# EAGLE design lp_rgb (EAGLE 6.6.0)
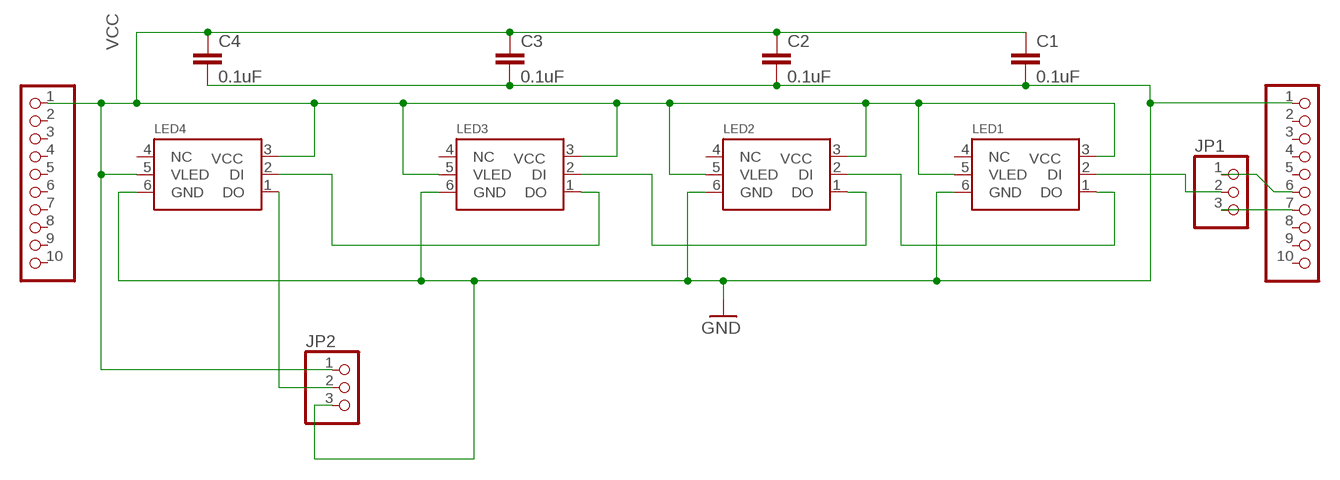
[diagram p0: schematic, sheet 1]

## Parts
C1  0.1uF  C-EUC0805  [C0805]
C2  0.1uF  C-EUC0805  [C0805]
C3  0.1uF  C-EUC0805  [C0805]
C4  0.1uF  C-EUC0805  [C0805]
J1  J1  PINHD-1X10  [1X10]
J2  J2  PINHD-1X10  [1X10]
JP1  PINHD-1X3  [1X03]
JP2  PINHD-1X3  [1X03]
LED1  5050WS2811W  [RGBLED5050W]
LED2  5050WS2811W  [RGBLED5050W]
LED3  5050WS2811W  [RGBLED5050W]
LED4  5050WS2811W  [RGBLED5050W]

## Nets
GND: C1.2 C2.2 C3.2 C4.2 J2.1 JP2.3 LED1.6(GND) LED2.6(GND) LED3.6(GND) LED4.6(GND)
N$1: J2.6 JP1.1
N$2: JP2.2 LED4.1(DO)
N$3: LED1.1(DO) LED2.2(DI)
N$4: LED2.1(DO) LED3.2(DI)
N$5: LED3.1(DO) LED4.2(DI)
N$6: J2.7 JP1.3
P1.6: JP1.2 LED1.2(DI)
VCC [VCC]: C1.1 C2.1 C3.1 C4.1 J1.1 JP2.1 LED1.3(VCC) LED1.5(VLED) LED2.3(VCC) LED2.5(VLED) LED3.3(VCC) LED3.5(VLED) LED4.3(VCC) LED4.5(VLED)
Unconnected: J1.2 J1.3 J1.4 J1.5 J1.6 J1.7 J1.8 J1.9 J1.10 J2.2 J2.3 J2.4 J2.5 J2.8 J2.9 J2.10 LED1.4(NC) LED2.4(NC) LED3.4(NC) LED4.4(NC)

## Library data of the parts
C1-C4 = resistor:C-EU: CAPACITOR, European symbol
J1 J2 = pinhead:PINHD-1X10: PIN HEADER
JP1 JP2 = pinhead:PINHD-1X3: PIN HEADER
LED1-LED4 = 5050WS2811:5050WS2811

## Net classes
0 default: width 0.406 mm, drill 0.508 mm
1 GND: width 0.813 mm, drill 0.508 mm
2 VCC: width 1.016 mm, drill 0.508 mm

## Board
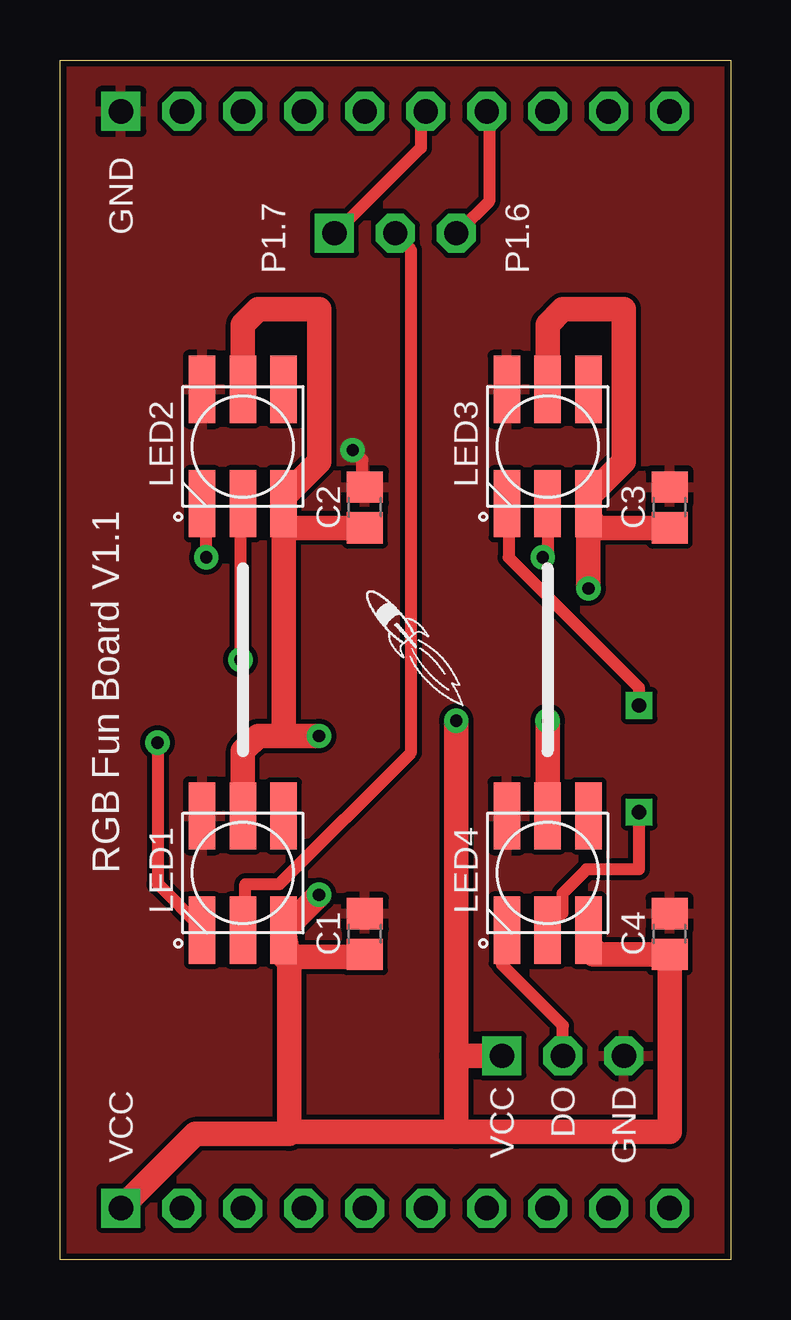
[diagram p1: board, top side]
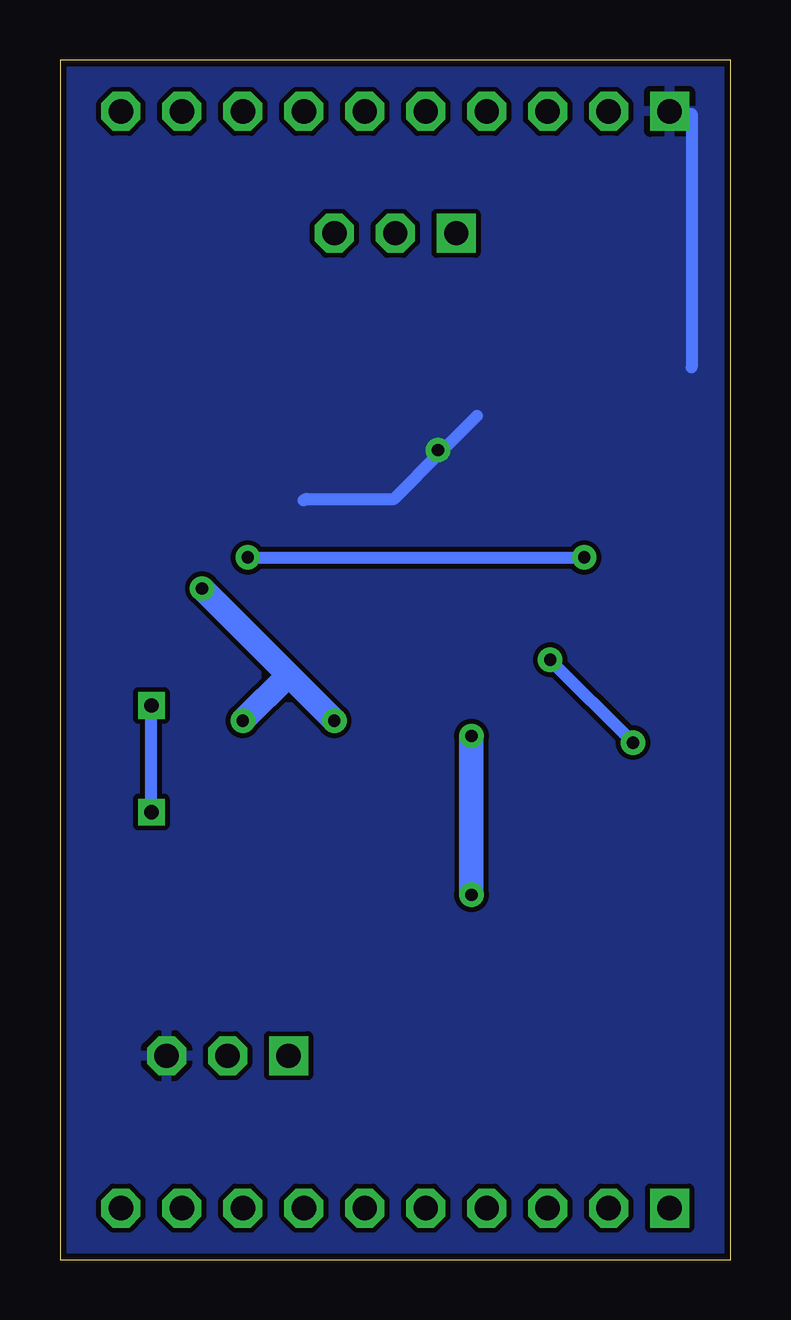
[diagram p2: board, bottom side, seen from below]

Size 27.94 x 50 mm. Coordinates in mm from the lower left corner, seen from the top.
Outline: 0,50 27.94,50 27.94,0 0,0 0,50
Copper layers (1*16): Top 0.035mm / dielectric 1.5mm / Bottom 0.035mm
Design rules "SparkFun *": minimum track width 20mil, minimum drill 20mil, track to track 8mil, track to pad 8mil, pad to pad 8mil, via to via 8mil, smd to smd 8mil, copper to edge 10mil, drill to drill 8mil, minimum pad ring 12mil, minimum via ring 10mil, stop-mask expansion 4mil, vias tented up to drill 25mil, thermal gap 10mil

### Footprints (pad centres in the part's own frame; a part is rotated, then mirrored left to right if it is on the bottom)
C0805 = smd 1.3 x 1.5: 1 -0.85,0; 2 0.85,0
1X10 = drill 1.016 square: 1 -11.43,0 | drill 1.016 octagon: 2 -8.89,0; 3 -6.35,0; 4 -3.81,0; 5 -1.27,0; 6 1.27,0; 7 3.81,0; 8 6.35,0; 9 8.89,0; 10 11.43,0
1X03 = drill 1.016 square: 1 -2.54,0 | drill 1.016 octagon: 2 0,0; 3 2.54,0
RGBLED5050W = smd 2.794 x 1.1: 1 -2.381,1.7; 2 -2.381,0; 3 -2.381,-1.7; 4 2.381,-1.7; 5 2.381,0; 6 2.381,1.7

### Placement (x,y rotation side)
C1  12.7,13.57 90 top
C2  12.7,31.35 90 top
C3  25.4,31.35 90 top
C4  25.4,13.57 90 top
J1  13.97,2.14 0 top
J2  13.97,47.86 0 top
JP1  13.97,42.78 0 top
JP2  20.95,8.49 0 top
LED1  7.62,16.11 90 top
LED2  7.62,33.89 90 top
LED3  20.32,33.89 90 top
LED4  20.32,16.11 90 top
U$2  [LOGO-ROCKET]  14.61,25.64 90 top

### Tracks (layer width: path | path; a pad name or v marks a point on that pad's centre or on a via)
GND  (via drill 0.51)
  Top 0.508: v12.19,33.74 12.6,33.33 12.6,32.32 C2.2
  Bottom 0.508: 12.09,33.64 14.02,31.71 17.68,31.71 17.79,31.64 | 12.09,33.64 10.57,35.16 | 1.63,37.19 1.63,47.76 2.44,47.76 J2.1 | v12.19,33.74 12.09,33.64
  pour Bottom: 29.17,51.47 29.17,-1.67 -1.37,-1.77 -1.37,51.67 2.54,51.67
  pour Top: -1.37,51.47 29.21,51.47 29.21,-1.67 -1.37,-1.77
N$1
  Top 0.508: JP1.1 11.58,42.88 15.04,46.34 15.04,47.55 15.24,47.76 J2.6
N$2
  Top 0.508: JP2.2 20.95,9.76 18.41,12.3 18.41,13.52 LED4.1
N$3  (via drill 0.51)
  Top 0.508: v4.06,21.55 4.06,15.65 5.89,13.82 LED1.1 | v7.52,25 7.52,31.5 LED2.2
  Bottom 0.508: v7.52,25 v4.06,21.55
N$4  (via drill 0.51)
  Top 0.508: v6.1,29.27 6.1,31.5 LED2.1 | v20.12,29.27 20.32,29.47 LED3.2
  Bottom 0.508: v20.12,29.27 v6.1,29.27
N$5  (via drill 0.6)
  Top 0.508: LED4.2 20.32,13.82 20.93,14.43 20.93,15.25 21.95,16.26 24.13,16.26 v24.13,18.65 | LED3.1 18.69,31.5 18.69,29.27 24.13,23.83 v24.13,23.1
  Bottom 0.508: v24.13,18.65 v24.13,23.1
N$6
  Top 0.508: JP1.3 16.66,42.88 17.88,44.1 17.88,47.76 J2.7
P1.6
  Top 0.508: JP1.2 14.02,42.68 14.63,42.07 14.63,21.14 9.14,15.65 7.72,15.65 7.72,13.82 LED1.2
VCC  (via drill 0.51)
  Top 1.016: C1.1 12.6,12.61 9.35,12.61 9.35,13.62 LED1.3 | 3.05,2.65 J1.1 5.64,5.24 9.55,5.24 9.55,5.31 | 9.55,5.31 9.55,12.4 LED1.3 | LED3.5 20.32,38.97 20.95,39.61 23.5,39.61 23.5,33.26 22.02,31.78 LED3.3 22.02,30.71 | LED2.5 7.62,38.97 8.26,39.61 10.79,39.61 10.79,33.26 9.32,31.78 LED2.3 9.32,30.5 | C2.1 9.32,30.5 | 16.51,5.31 25.4,5.31 C4.1 22.23,12.72 22.23,12.94 22.02,12.94 LED4.3 | 16.51,5.31 9.55,5.31 | C3.1 22.23,30.5 22.23,30.71 22.02,30.71 | LED1.5 7.62,21.19 8.26,21.83 9.53,21.83 | 9.53,21.83 v10.79,21.83 | v10.79,15.2 LED1.3 | 9.32,30.5 9.32,22.03 9.53,21.83 | 22.02,30.71 v22.02,27.97 | v16.51,22.46 16.51,8.49 | 16.51,8.49 16.51,5.31 | LED4.5 v20.32,22.46 | JP2.1 16.51,8.49
  Bottom 1.016: v10.79,21.83 v10.79,15.2 | v22.02,27.97 18.41,24.37 | 18.41,24.37 v16.51,22.46 | v20.32,22.46 18.41,24.37

### Text on the board
tNames: GND | P1.7 | P1.6 | RGB Fun Board V1.1 | VCC | DO | GND | VCC